# EAGLE design tentacle_module (EAGLE 7.1.0)
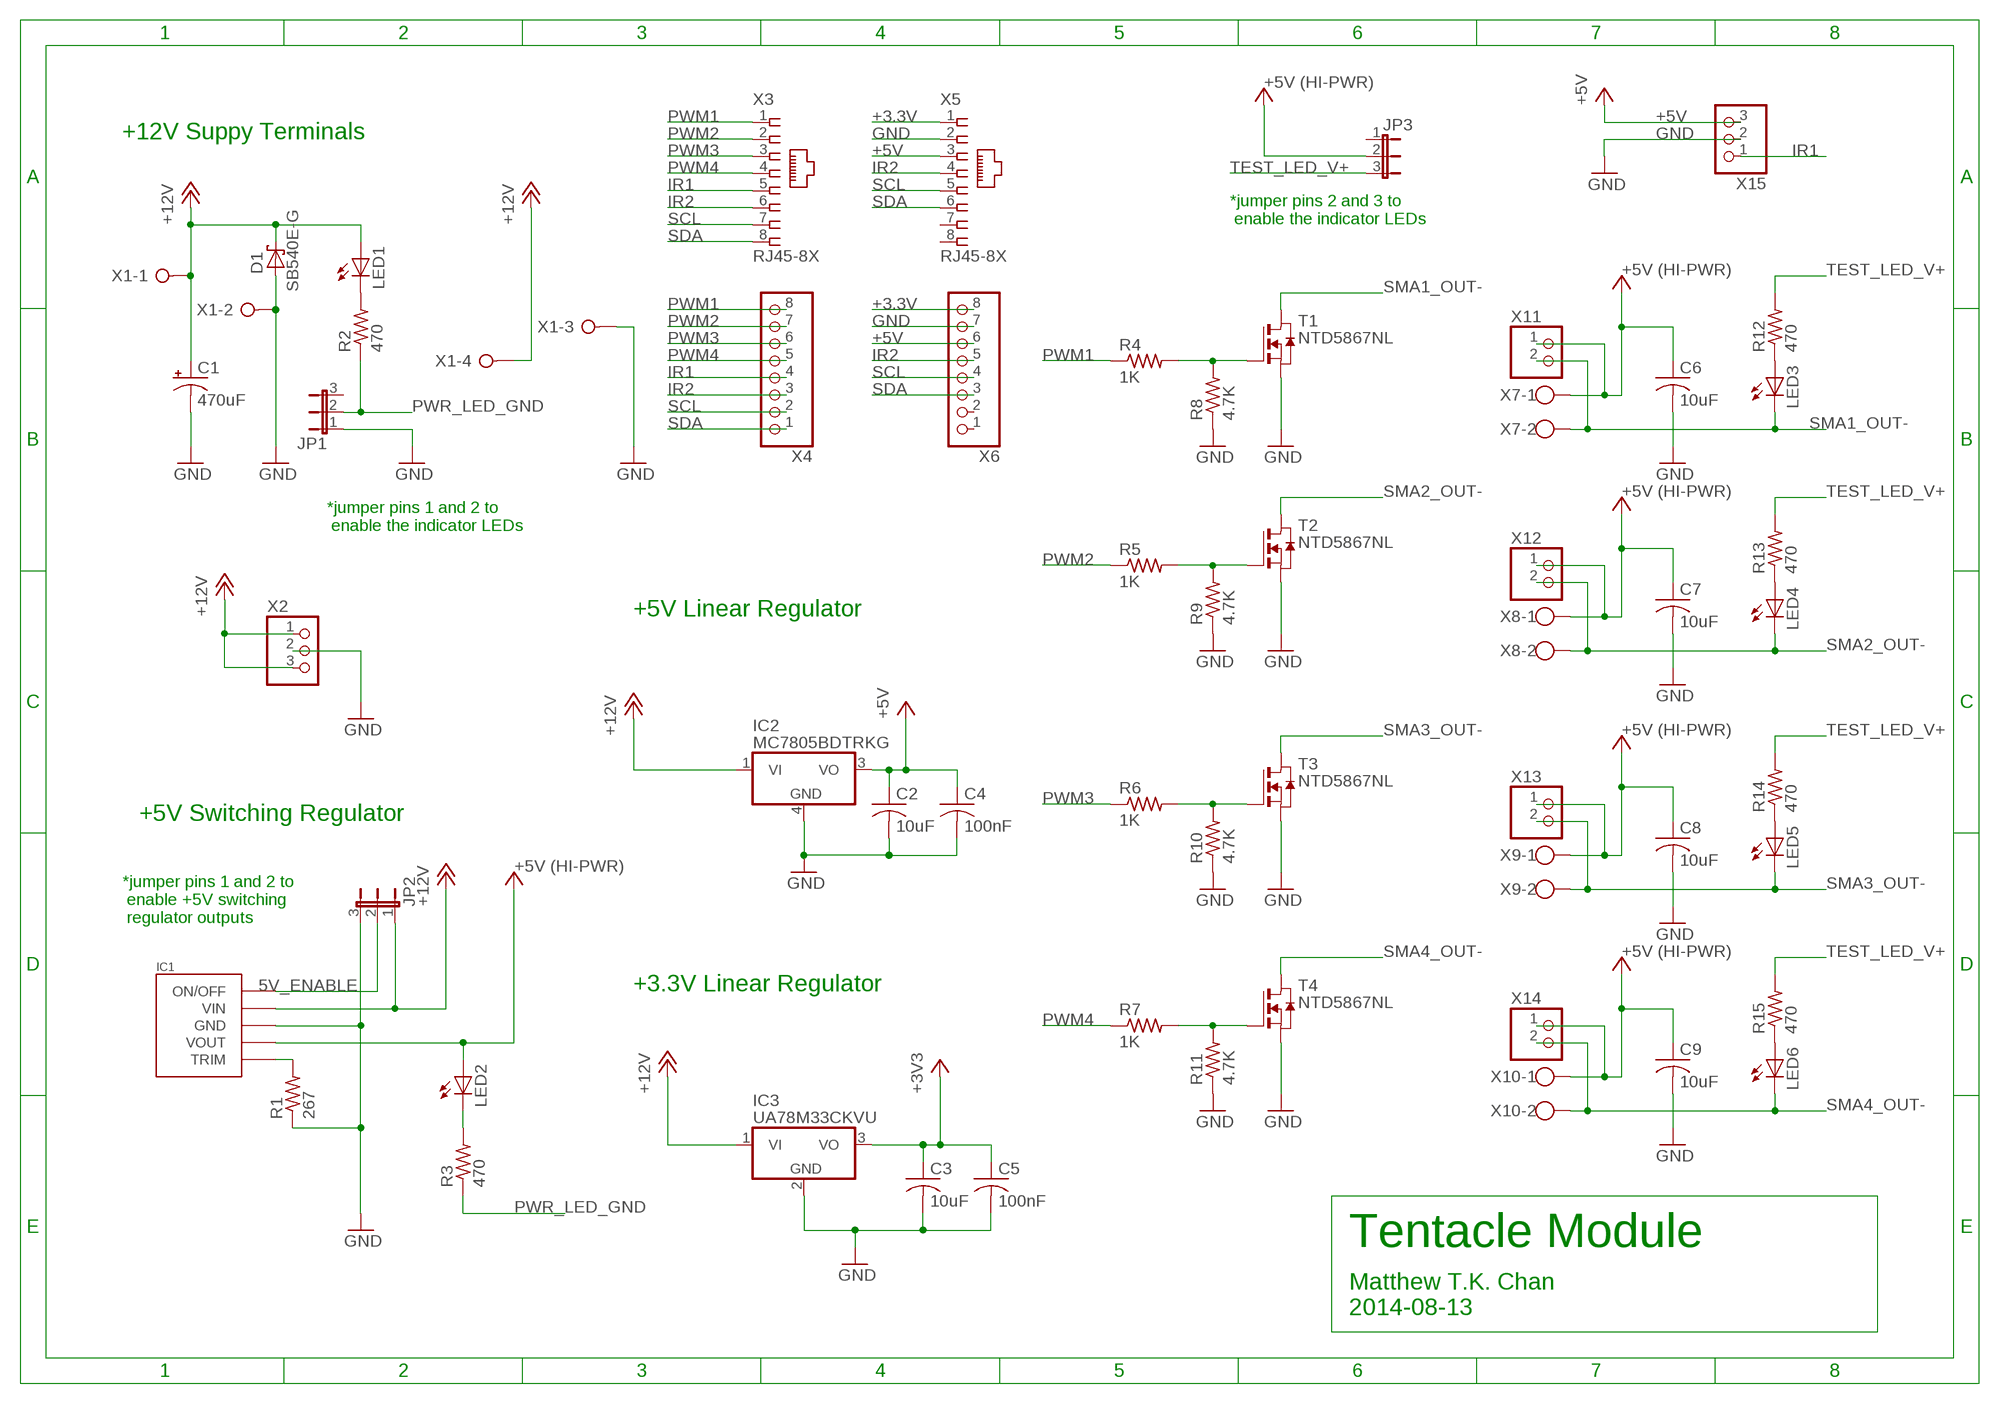
[diagram p0: schematic, sheet 1]

## Parts
C1  470uF  CPOL-USE5-10.5  [E5-10,5]
C2  10uF  C-USC0603  [C0603]
C3  10uF  C-USC0603  [C0603]
C4  100nF  C-USC0603  [C0603]
C5  100nF  C-USC0603  [C0603]
C6  10uF  C-USC0603  [C0603]
C7  10uF  C-USC0603  [C0603]
C8  10uF  C-USC0603  [C0603]
C9  10uF  C-USC0603  [C0603]
D1  SB540E-G  [DO201T15]
IC1  OKR-T/10-W12  [OKR-C90]
IC2  MC7805BDTRKG  [DPACK_3]
IC3  UA78M33CKVU  [DPACK]
JP1  JP2E  [JP2]
JP2  JP2E  [JP2]
JP3  JP2E  [JP2]
LED1  LEDSML1206  [SML1206]
LED2  LEDSML1206  [SML1206]
LED3  LEDSML1206  [SML1206]
LED4  LEDSML1206  [SML1206]
LED5  LEDSML1206  [SML1206]
LED6  LEDSML1206  [SML1206]
R1  267  R-US_R0603  [R0603]
R2  470  R-US_R0603  [R0603]
R3  470  R-US_R0603  [R0603]
R4  1K  R-US_R0603  [R0603]
R5  1K  R-US_R0603  [R0603]
R6  1K  R-US_R0603  [R0603]
R7  1K  R-US_R0603  [R0603]
R8  4.7K  R-US_R0603  [R0603]
R9  4.7K  R-US_R0603  [R0603]
R10  4.7K  R-US_R0603  [R0603]
R11  4.7K  R-US_R0603  [R0603]
R12  470  R-US_R0603  [R0603]
R13  470  R-US_R0603  [R0603]
R14  470  R-US_R0603  [R0603]
R15  470  R-US_R0603  [R0603]
T1  NTD5867NL  NTD5867NLT4G  [DPACK]
T2  NTD5867NL  NTD5867NLT4G  [DPACK]
T3  NTD5867NL  NTD5867NLT4G  [DPACK]
T4  NTD5867NL  NTD5867NLT4G  [DPACK]
X1  W237-04P  [W237-4P]
X2  PINHD-1X3/90  [1X03/90]
X3  RJ45-8X  [RJ45-NO-SHIELD]
X4  PINHD-1X8  [1X08]
X5  RJ45-8X  [RJ45-NO-SHIELD]
X6  PINHD-1X8  [1X08]
X7  W237-102  [W237-102]
X8  W237-102  [W237-102]
X9  W237-102  [W237-102]
X10  W237-102  [W237-102]
X11  PINHD-1X2/90  [1X02/90]
X12  PINHD-1X2/90  [1X02/90]
X13  PINHD-1X2/90  [1X02/90]
X14  PINHD-1X2/90  [1X02/90]
X15  PINHD-1X3/90  [1X03/90]

## Nets
5V_ENABLE: IC1.ON/OFF JP2.2
+3.3V: C3.1 C5.1 IC3.3(VO) X5.1 X6.8 ; supply symbol labelled +3V3
+5V: C2.1 C4.1 IC2.3(VO) X5.3 X6.6 X15.3
+5V_HI-PWR: C6.1 C7.1 C8.1 C9.1 IC1.VOUT JP3.2 LED2.A X7.1 X8.1 X9.1 X10.1 X11.1 X12.1 X13.1 X14.1 ; supply symbol labelled +5V (HI-PWR)
+12V: C1.+ D1.C IC1.VIN IC2.1(VI) IC3.1(VI) JP2.1 LED1.A X1.1 X1.4 X2.1 X2.3
GND: C1.- C2.2 C3.2 C4.2 C5.2 C6.2 C7.2 C8.2 C9.2 D1.A IC1.GND IC2.4(GND) IC3.2(GND) JP1.1 JP2.3 R1.1 R8.1 R9.1 R10.1 R11.1 T1.3(S) T2.3(S) T3.3(S) T4.3(S) X1.2 X1.3 X2.2 X5.2 X6.7 X15.2
IR1: X3.5 X4.4 X15.1
IR2: X3.6 X4.3 X5.4 X6.5
N$1: R5.2 R9.2 T2.1(G)
N$2: R6.2 R10.2 T3.1(G)
N$3: R7.2 R11.2 T4.1(G)
N$4: R4.2 R8.2 T1.1(G)
N$5: LED3.A R12.1
N$6: IC1.TRIM R1.2
N$7: LED2.C R3.2
N$10: LED1.C R2.2
N$12: LED4.A R13.1
N$13: LED5.A R14.1
N$14: LED6.A R15.1
PWM1: R4.1 X3.1 X4.8
PWM2: R5.1 X3.2 X4.7
PWM3: R6.1 X3.3 X4.6
PWM4: R7.1 X3.4 X4.5
PWR_LED_GND: JP1.2 R2.1 R3.1
SCL: X3.7 X4.2 X5.5 X6.4
SDA: X3.8 X4.1 X5.6 X6.3
SMA1_OUT-: LED3.C T1.2(D) X7.2 X11.2
SMA2_OUT-: LED4.C T2.2(D) X8.2 X12.2
SMA3_OUT-: LED5.C T3.2(D) X9.2 X13.2
SMA4_OUT-: LED6.C T4.2(D) X10.2 X14.2
TEST_LED_V+: JP3.3 R12.2 R13.2 R14.2 R15.2
Unconnected: JP1.3 JP3.1 X5.7 X5.8 X6.1 X6.2

## Notes on the sheet
- +12V Suppy Terminals
- *jumper pins 2 and 3 to
   enable the indicator LEDs
- *jumper pins 1 and 2 to
   enable the indicator LEDs
- +5V Linear Regulator
- +5V Switching Regulator
- *jumper pins 1 and 2 to
   enable +5V switching 
   regulator outputs
- +3.3V Linear Regulator
- Tentacle Module
- Matthew T.K. Chan
  2014-08-13

## Library data of the parts
C1 = rcl:CPOL-US: POLARIZED CAPACITOR, American symbol
C2-C9 = rcl:C-US: CAPACITOR, American symbol
D1 = CBLA_Test_bed_Library:SB540E-G: SCHOTTKY BARRIER RECTIFIER 3.0 AMPERES 20, 30, 40 VOLT Source: MBRS340T3-D.pdf
IC1 = CBLA_Test_bed_Library:OKR-T/10-W12: 5V/10A Murata POL DC/DC Converter
IC2 = CBLA_Test_bed_Library:MC78: 1A Positive Voltage Regulators Source: Data sheet <http://www.onsemi.com/pub_link/Collateral/MC7800-D.PDF>
IC3 = CBLA_Test_bed_Library:UA78M: Linear Voltage Reg Datasheet <http://www.ti.com/lit/ds/symlink/ua78m05.pdf>
JP1-JP3 = jumper:JP2E: JUMPER
LED1-LED6 = led:LED: LED OSRAM: - CHIPLED LG R971, LG N971, LY N971, LG Q971, LY Q971, LO R971, LY R971 LH N974, LH R974 LS Q976, LO Q976, LY Q976 LO Q996 - Hyper CHIPLED LW Q18S LB Q993, LB Q99A, LB R99A - SideLED LS A670, LO A670, LY A670, LG A670, LP A670 LB A673, LV A673, LT A673, LW A673 LH A674 LY A675 LS A676, LA A676, LO A676, LY A676, LW A676 LS A679, LY A679, LG A679 - Hyper Micro SIDELED® LS Y876, LA Y876, LO Y876, LY Y876 LT Y87S - SmartLED LW L88C, LW L88S LB L89C, LB L89S, LG L890 LS L89K, LO L89K, LY L89K LS L896, LA L896, LO L896, LY L896 - TOPLED LS T670, LO T670, LY T670, LG T670, LP T670 LSG T670, LSP T670, LSY T670, LOP T670, LYG T670 LG T671, LOG T671, LSG T671 LB T673, LV T673, LT T673, LW T673 LH T674 LS T676, LA T676, LO T676, LY T676, LB T676, LH T676, LSB T676, LW T676 LB T67C, LV T67C, LT T67C, LS T67K, LO T67K, LY T67K, LW E67C LS E67B, LA E67B, LO E67B, LY E67B, LB E67C, LV E67C, LT E67C LW T67C LS T679, LY T679, LG T679 LS T770, LO T770, LY T770, LG T770, LP T770 LB T773, LV T773, LT T773, LW T773 LH T774 LS E675, LA E675, LY E675, LS T675 LS T776, LA T776, LO T776, LY T776, LB T776 LHGB T686 LT T68C, LB T68C - Hyper Mini TOPLED® LB M676 - Mini TOPLED Santana® LG M470 LS M47K, LO M47K, LY M47K Source: http://www.osram.convergy.de LUXEON: - LUMILED® LXK2-PW12-R00, LXK2-PW12-S00, LXK2-PW14-U00, LXK2-PW14-V00 LXK2-PM12-R00, LXK2-PM12-S00, LXK2-PM14-U00 LXK2-PE12-Q00, LXK2-PE12-R00, LXK2-PE12-S00, LXK2-PE14-T00, LXK2-PE14-U00 LXK2-PB12-K00, LXK2-PB12-L00, LXK2-PB12-M00, LXK2-PB14-N00, LXK2-PB14-P00, LXK2-PB14-Q00 LXK2-PR12-L00, LXK2-PR12-M00, LXK2-PR14-Q00, LXK2-PR14-R00 LXK2-PD12-Q00, LXK2-PD12-R00, LXK2-PD12-S00 LXK2-PH12-R00, LXK2-PH12-S00 LXK2-PL12-P00, LXK2-PL12-Q00, LXK2-PL12-R00 Source: www.luxeon.com KINGBRIGHT: KA-3528ASYC Source: www.kingbright.com
R1-R15 = CBLA_Test_bed_Library:R-US_: RESISTOR, American symbol
T1-T4 = CBLA_Test_bed_Library:NTD5867NL: MOS FET
X1 = con-wago-508:W237-04P: WAGO SREW CLAMP; OC_FARNELL: unknown; OC_NEWARK: unknown
X2 X15 = CBLA_Test_bed_Library:PINHD-1X3: PIN HEADER
X3 X5 = CBLA_Test_bed_Library:RJ45: CORCOM Modular RJ Jacks No Shield Source: www.tycoelectronics.com .. ENG_DS_1654001_1099_RJ_L_0507.pdf; MPN: RJ45-8X; OC_FARNELL: unknown; OC_NEWARK: 16R6101
X4 X6 = CBLA_Test_bed_Library:PINHD-1X8: PIN HEADER
X7-X10 = con-wago-500:W237-102: WAGO SCREW CLAMP; MPN: 237-102; OC_FARNELL: unknown; OC_NEWARK: 70K9898
X11-X14 = CBLA_Test_bed_Library:PINHD-1X2: PIN HEADER

## Board
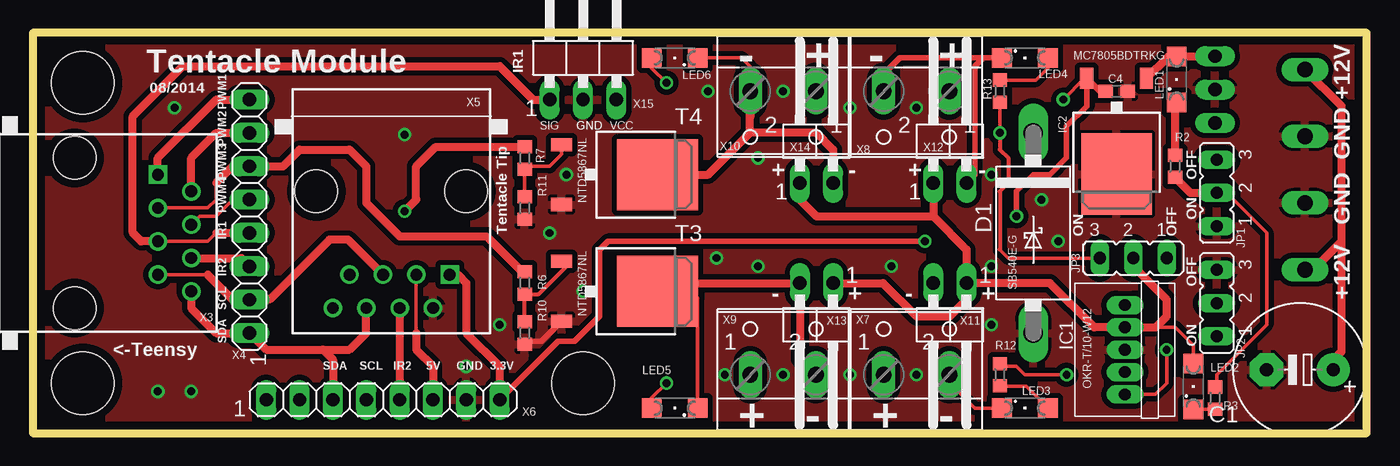
[diagram p1: board, top side]
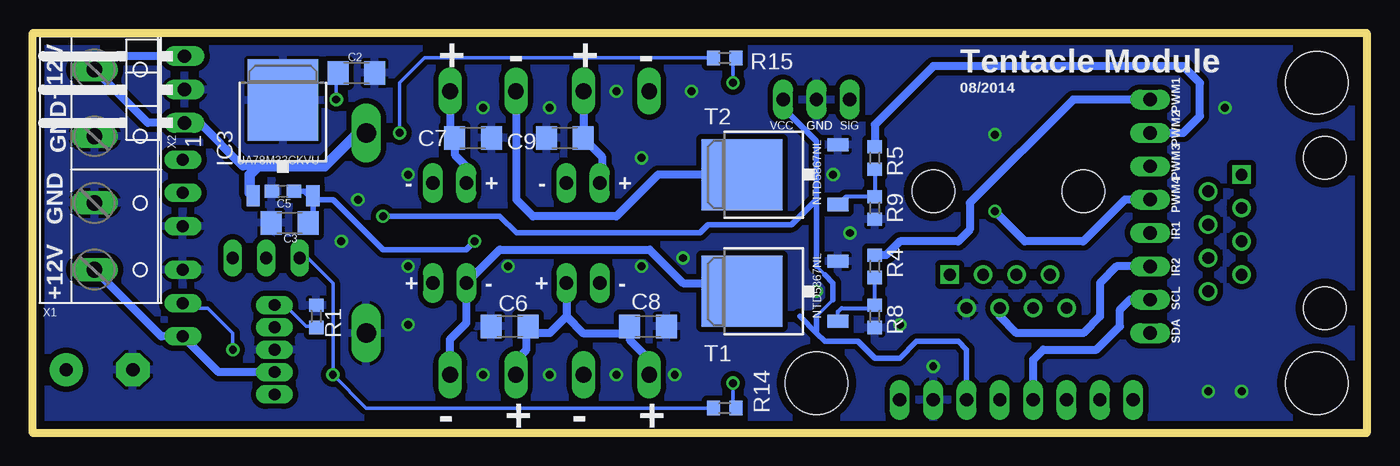
[diagram p2: board, bottom side, seen from below]

Size 101.6 x 30.48 mm. Coordinates in mm from the lower left corner, seen from the top.
Outline: 0,0 101.6,0 101.6,30.48 0,30.48 0,0
Copper layers (1*16): Top 0.035mm / dielectric 1.5mm / Bottom 0.035mm
Design rules "design_rule_settings": minimum track width 10mil, minimum drill 20mil, track to track 10mil, track to pad 10mil, pad to pad 10mil, via to via 10mil, smd to smd 10mil, copper to edge 24mil, drill to drill 10mil, minimum pad ring 10mil, minimum via ring 8mil, stop-mask expansion 4mil, vias tented up to drill 0mil, thermal gap 10mil
Holes 4.76 mm at 3.81,3.81 41.91,3.81 3.81,26.67

### Footprints (pad centres in the part's own frame; a part is rotated, then mirrored left to right if it is on the bottom)
E5-10,5 = drill 1.016 pad 2.54: + -2.54,0 | drill 1.016 pad 2.54 octagon: - 2.54,0
C1206 = smd 1.6 x 1.8: 1 -1.4,0; 2 1.4,0
C0603 = smd 1.1 x 1: 1 -0.85,0; 2 0.85,0
DO201T15 = drill 1.499 long: A 7.62,0; C -7.62,0
OKR-C90 = drill 0.9 long: GND 0,0; ON/OFF 3.404,0; TRIM -3.404,0; VIN 1.702,0; VOUT -1.702,0
DPACK_3 = smd 1 x 1.6: 1 -2.28,-4.8; 3 2.28,-4.8 | smd 5.4 x 6.2: 4 0,2.5
DPACK = smd 1 x 1.6: 1 -2.28,-4.8; 3 2.28,-4.8 | smd 5.4 x 6.2: 2 0,2.5
JP2 = drill 0.914 long: 1 -2.54,0; 2 0,0; 3 2.54,0
SML1206 = smd 1.5 x 1.5: A 1.75,0; C -1.75,0
R0603 = smd 1 x 1.1: 1 -0.85,0; 2 0.85,0
W237-4P = drill 1.194 long: 1 -7.62,-0.635; 2 -2.54,-0.635; 3 2.54,-0.635; 4 7.62,-0.635
1X03/90 = drill 1.016 long: 1 -2.54,-3.81; 2 0,-3.81; 3 2.54,-3.81
RJ45-NO-SHIELD = drill 0.9 pad 1.4 square: 1 -4.445,6.35 | drill 0.9 pad 1.4: 2 -3.175,8.89; 3 -1.905,6.35; 4 -0.635,8.89; 5 0.635,6.35; 6 1.905,8.89; 7 3.175,6.35; 8 4.445,8.89 | hole 3.251: -5.715,0; 5.715,0
1X08 = drill 1.016 long: 1 -8.89,0; 2 -6.35,0; 3 -3.81,0; 4 -1.27,0; 5 1.27,0; 6 3.81,0; 7 6.35,0; 8 8.89,0
W237-102 = drill 1.194 long: 1 -2.5,-1.27; 2 2.5,-1.27
1X02/90 = drill 1.016 long: 1 -1.27,-3.81; 2 1.27,-3.81

### Placement (x,y rotation side)
C1  96.52,4.83 180 top
C2  10uF  [C1206]  76.96,27.43 0 bottom
C3  10uF  [C1206]  82.04,16 180 bottom
C4  82.55,26.04 0 top
C5  82.55,18.41 180 bottom
C6  10uF  [C1206]  65.28,8.13 180 bottom
C7  10uF  [C1206]  68.07,22.48 0 bottom
C8  10uF  [C1206]  54.74,8.13 0 bottom
C9  10uF  [C1206]  61.09,22.48 180 bottom
D1  76.2,15.24 270 top
IC1  83.19,6.35 270 top
IC2  82.55,22.23 180 top
IC3  82.55,22.86 0 bottom
JP1  90.17,18.29 90 top
JP2  90.17,9.91 90 top
JP3  83.82,13.34 180 top
LED1  87.12,26.92 90 top
LED2  88.39,3.56 90 top
LED3  75.56,1.91 0 top
LED4  75.56,28.57 0 top
LED5  48.9,1.91 180 top
LED6  48.9,28.57 180 top
R1  80.01,8.89 270 bottom
R2  87,20.32 90 top
R3  90.04,2.67 270 top
R4  37.47,12.7 270 bottom
R5  37.47,20.95 270 bottom
R6  37.47,11.43 270 top
R7  37.47,20.95 270 top
R8  37.47,8.89 90 bottom
R9  37.47,17.14 90 bottom
R10  37.47,7.62 90 top
R11  37.47,17.14 90 top
R12  73.66,4.45 90 top
R13  73.66,26.04 270 top
R14  48.9,1.91 180 bottom
R15  48.9,28.57 180 bottom
T1  45.09,10.79 90 bottom
T2  45.09,19.68 90 bottom
T3  45.09,10.79 270 top
T4  45.09,19.68 270 top
X1  96.27,20.07 270 bottom
X2  93.85,26.16 90 bottom
X3  3.17,15.24 270 top
X4  16.51,16.51 90 top
X5  27.3,18.41 180 top
X6  26.67,2.54 0 top
X7  67.31,5.71 0 top
X8  67.31,24.77 180 top
X9  57.15,5.71 0 top
X10  57.15,24.77 180 top
X11  69.85,7.62 180 top
X12  69.85,22.86 0 top
X13  59.69,7.62 180 top
X14  59.69,22.86 0 top
X15  41.91,29.21 0 top

### Tracks (layer width: path | path; a pad name or v marks a point on that pad's centre or on a via)
5V_ENABLE  (via drill 0.6)
  Top 0.254: IC1.ON/OFF 85.5,2.95 86.36,3.81 v86.36,6.35
  Bottom 0.254: v86.36,6.35 86.36,7.62 88.27,9.53 89.79,9.53 JP2.2
+3.3V  (via drill 0.6)
  Top 0.406: v67.94,14.61 43.81,14.61 43.18,13.97 43.18,8.89 41.27,6.99 40.01,6.99 X6.8
  Top 0.61: X5.1 32.38,12.06 33.02,11.43 33.02,7.62 35.56,5.08 X6.8
  Bottom 0.406: v67.94,14.61 68.58,13.97 74.93,13.97 78.74,17.78 80.01,17.78 80.27,18.04 IC3.3 80.62,18.41 C5.1 80.9,18.41 80.26,17.78 80.26,16.38 C3.1
+5V  (via drill 0.6)
  Top 0.254: X5.3 29.21,7.62 | IC2.3 80.11,27.02 v78.49,25.4
  Top 0.406: v74.93,16.51 74.93,18.41 76.2,19.68 77.47,19.68 78.74,20.95 78.74,23.37 80.27,24.9 IC2.3 81.26,26.04 C4.1
  Top 0.61: 29.21,7.62 29.21,6.35 30.48,5.08 X6.6
  Bottom 0.254: 41.91,12.7 41.27,12.06 | 40.64,10.16 41.91,8.89 | v78.49,25.4 78.49,27.31 C2.1
  Bottom 0.406: v74.93,16.51 66.04,16.51 64.77,15.24 50.8,15.24 50.16,15.88 43.81,15.88 41.91,17.78 | 30.48,3.81 X6.6 30.48,6.35 31.11,6.99 34.29,6.99 35.56,5.71 37.47,5.71 38.73,6.99 41.27,6.99 41.91,7.62 | 41.91,7.62 43.18,8.89 | 41.91,17.78 41.91,12.7 | 41.27,12.06 40.64,11.43 40.64,10.16 | 41.91,8.89 41.91,7.62 | X15.3 44.45,24.77 41.91,22.23 41.91,17.78
+5V_HI-PWR
  Top 0.254: IC1.VOUT 87.04,8.05 88.39,6.7 LED2.A
  Top 0.61: JP3.2 83.82,12.7 86.36,10.16 86.36,8.89 85.52,8.05 IC1.VOUT 80.85,8.05 77.47,11.43 X11.1 | X12.1 68.58,16.51 | 68.58,16.51 71.12,13.97 X11.1 | X14.1 58.42,17.78 59.69,16.51 68.58,16.51 | X13.1 64.77,11.43 67.31,8.89 69.85,8.89 71.12,10.16 X11.1
  Bottom 0.61: X13.1 60.96,8.89 | 60.96,8.89 59.69,7.62 56.39,7.62 56.14,7.37 | 60.96,8.89 62.23,7.62 63.37,7.62 C6.1 64.01,8 64.01,6.35 64.81,5.55 X7.1 | X14.1 58.2,19.27 58.2,21 C9.1 59.65,22.52 X10.1 | X8.1 69.81,22.82 C7.1 69.47,21.21 68.58,20.32 X12.1 | C8.1 56.14,7.37 | 56.14,7.37 56.14,7.12 54.61,5.59 54.61,4.49 X9.1
+12V
  Top 0.61: X1.4 97.54,12.45 99.69,14.61 | 99.69,14.61 99.69,24.89 X1.1 | 99.69,14.61 99.69,6.22 99.06,5.59 C1.+ | 84.83,26.93 IC2.1 86.48,28.67 LED1.A 90.02,28.67 X2.3
  Bottom 0.406: IC3.1 85.09,18.32
  Bottom 0.61: X2.3 95.89,28.7 X1.1 92.84,23.62 X2.1 88.9,23.62 85.6,20.32 84.45,20.32 | IC1.VIN 87.45,4.65 JP2.1 91.82,7.37 X1.4
  Bottom 0.813: D1.C 76.83,22.86 79.38,20.32 84.45,20.32 85.09,19.68 85.09,18.32
GND  (via drill 0.6)
  Top 0.406: R10.1 37.68,6.99 38.73,6.99 40.27,8.52 T3.3
  other vias: 39.37,15.24 40.64,19.68 52.7,4.45 12.06,3.17 9.53,3.17 10.79,24.77 28.32,22.73 51.44,26.04 73.03,8.26 78.11,14.61 67.31,24.77 67.31,4.45 62.23,4.45 57.15,4.45 33.02,5.08 41.91,10.79 55.24,12.7 52.07,13.34 35.56,8.26 55.24,20.95 76.83,17.78 62.23,24.77 57.15,26.04 65.41,12.7 73.03,12.7 73.03,19.68
  pour Top (isolate 0.406, hatched): 0,30.48 0,0 101.6,0 101.6,1.27 101.6,30.48
  pour Bottom (isolate 0.406, hatched): 0,30.48 0,0 101.6,0 101.6,30.48
IR1
  Top 0.254: X3.5 13.34,14.61 13.97,15.24
  Top 0.61: 13.97,15.24 X4.4 | X3.5 8.26,14.61 7.62,15.24 7.62,24.13 11.43,27.94 35.56,27.94 38.1,25.4 X15.1
IR2
  Top 0.61: X5.4 X6.5 | X3.6 15.88,13.34 X4.3
  Bottom 0.61: X5.4 27.94,8.89 26.67,7.62 21.59,7.62 20.32,8.89 20.32,11.43 19.05,12.7 X4.3
N$1
  Bottom 0.305: R5.2 R9.2 39.7,18 T2.1
N$2
  Top 0.305: T3.1 40.64,12.72 40.64,12.7 38.52,10.58 R6.2 R10.2
N$3
  Top 0.254: R11.2 R7.2 37.68,20.32 39.37,20.32 40.28,21.23 T4.1
N$4
  Bottom 0.305: T1.1 40.28,9.24 40.01,9.53 37.68,9.53 R8.2 R4.2
N$5
  Top 0.254: 77.22,2.03 75.69,3.56 73.66,3.56 R12.1
  Top 0.406: 77.22,2.03 77.22,2 LED3.A
N$6
  Bottom 0.254: R1.2 80.01,8.13 80.77,8.13 82.4,9.75 IC1.TRIM
N$7
  Top 0.254: LED2.C 90.03,1.81 R3.2
N$10
  Top 0.61: LED1.C 87,25.05 R2.2
N$12
  Top 0.254: R13.1 76.42,26.89 77.47,27.94 77.47,28.42 LED4.A
N$13  (via drill 0.6)
  Top 0.254: LED5.A 47.15,2.69 v48.26,3.81
  Bottom 0.254: v48.26,3.81 48.26,2.12 R14.1
N$14  (via drill 0.6)
  Top 0.254: LED6.A 47.15,27.79 v48.26,26.67
  Bottom 0.254: v48.26,26.67 48.26,28.36 R15.1
PWM1
  Top 0.61: X3.1 9.53,20.95 13.97,25.4 X4.8
  Bottom 0.61: X4.8 22.35,25.4 30.23,17.53 30.23,15.49 31.11,14.61 35.56,14.61 36.62,13.55 R4.1
PWM2
  Top 0.61: X3.2 12.06,20.95 13.97,22.86 X4.7
  Bottom 0.61: X4.7 13.97,22.86 12.7,24.13 12.7,26.67 13.97,27.94 33.02,27.94 37.47,23.5 R5.1
PWM3
  Top 0.254: X3.3 13.34,17.14 13.97,17.78 13.97,19.05
  Top 0.61: 13.97,19.05 15.24,20.32 X4.6 19.05,20.32 20.32,21.59 24.13,21.59 25.4,20.32 25.4,17.53 27.94,14.99 34.54,14.99 37.25,12.28 R6.1
PWM4  (via drill 0.6)
  Top 0.254: X3.4 12.7,16.51 13.97,16.51 15.24,17.78 X4.5
  Top 0.61: v28.32,16.89 29.21,17.78 29.21,20.32 30.7,21.8 R7.1
  Bottom 0.61: X4.5 18.41,17.78 21.59,14.61 26.04,14.61 v28.32,16.89
PWR_LED_GND
  Top 0.254: JP1.2 90.93,18.29 93.98,15.24 93.98,8.26 90.17,4.45 90.17,3.64 R3.1
  Top 0.61: R2.1 88.18,18.29 JP1.2
SCL
  Top 0.254: 13.34,12.06 X3.7
  Top 0.61: 13.34,12.06 15.24,10.16 X4.2 18.03,10.16 22.61,14.73 24,14.73 X5.5
  Bottom 0.61: X6.4 25.4,5.59 24.64,6.35 20.57,6.35 18.8,8.13 18.8,9.4 18.03,10.16 X4.2
SDA
  Top 0.61: X3.8 12.06,9.53 13.97,7.62 X4.1 17.78,6.35 22.1,6.35 | 22.1,6.35 22.86,5.59 X6.3 | 22.1,6.35 24.13,6.35 25.4,7.62 X5.6
SMA1_OUT-
  Top 0.254: X7.2 69.81,3.85 71.75,1.91 LED3.C
  Bottom 0.305: 49.53,11.43 48.22,11.43 T1.2
  Bottom 0.61: 49.53,11.43 52.07,11.43 54.61,13.97 66.04,13.97 X11.2 68.58,8.38 69.85,7.11 69.85,4.49 X7.2
SMA2_OUT-
  Top 0.254: 73.03,28.57 LED4.C
  Top 0.406: X12.2 71.75,19.68 71.75,27.94 72.39,28.57 | 72.39,28.57 73.03,28.57 | 72.39,28.57 66.04,28.57 64.81,27.34 X8.2
  Bottom 0.61: T2.2 53.98,19.68 57.15,16.51 63.5,16.51 64.77,17.78 64.77,26 X8.2
SMA3_OUT-
  Top 0.254: LED5.C 50.65,10.31 49.53,11.43
  Top 0.61: X9.2 58.42,5.67 X13.2 49.53,11.43 48.22,11.43 T3.2
SMA4_OUT-
  Top 0.254: LED6.C 53.98,28.57 54.61,27.94 54.61,25.44 54.65,25.4
  Top 0.61: X10.2 54.65,25.4 54.65,24.09 | X14.2 60.96,21.59 59.69,22.86 54.61,22.86 | T4.2 51.44,19.68 54.61,22.86 | 54.61,22.86 54.61,25.44
TEST_LED_V+  (via drill 0.6)
  Top 0.254: v78.74,4.45 75.56,4.45 74.93,5.08 73.88,5.08 | R13.2 v73.66,22.86 | 73.66,13.97 74.3,13.34 JP3.3
  Top 0.305: v73.66,22.86 73.66,21.59 74.3,20.95 74.3,19.05 73.66,18.41 73.66,13.97
  Top 0.406: 73.88,5.08 R12.2
  Bottom 0.254: JP3.3 80.64,13.34 78.74,11.43 v78.74,4.45 76.2,1.91 R14.2 | R15.2 71.75,28.57 73.66,26.67 v73.66,22.86

### Text on the board
tPlace: - | - | + | + | - | - | + | + | MC7805BDTRKG | Tentacle Module | IR1 | 08/2014 | PWM1 | +12V | SIG | GND | GND | VCC | PWM2 | Tentacle Tip | GND | PWM3 | + | - | + | - | OFF | NTD5867NL | PWM4 | ON | GND | IR1 | ON | OFF | IR2 | SB540E-G | OFF | - | + | - | + | +12V | SCL | NTD5867NL | SDA | ON | <-Teensy | SDA | SCL | IR2 | 5V | GND | 3.3V | + | - | + | -
bPlace: - | + | - | + | Tentacle Module | 08/2014 | +12V | PWM1 | SIG | GND | GND | VCC | PWM2 | NTD5867NL | UA78M33CKVU | GND | PWM3 | + | - | + | - | PWM4 | GND | IR1 | NTD5867NL | IR2 | - | + | - | + | +12V | SCL | SDA | + | - | + | -